# EAGLE schematic Armament HUD Control Panel (EAGLE 7.4.0)
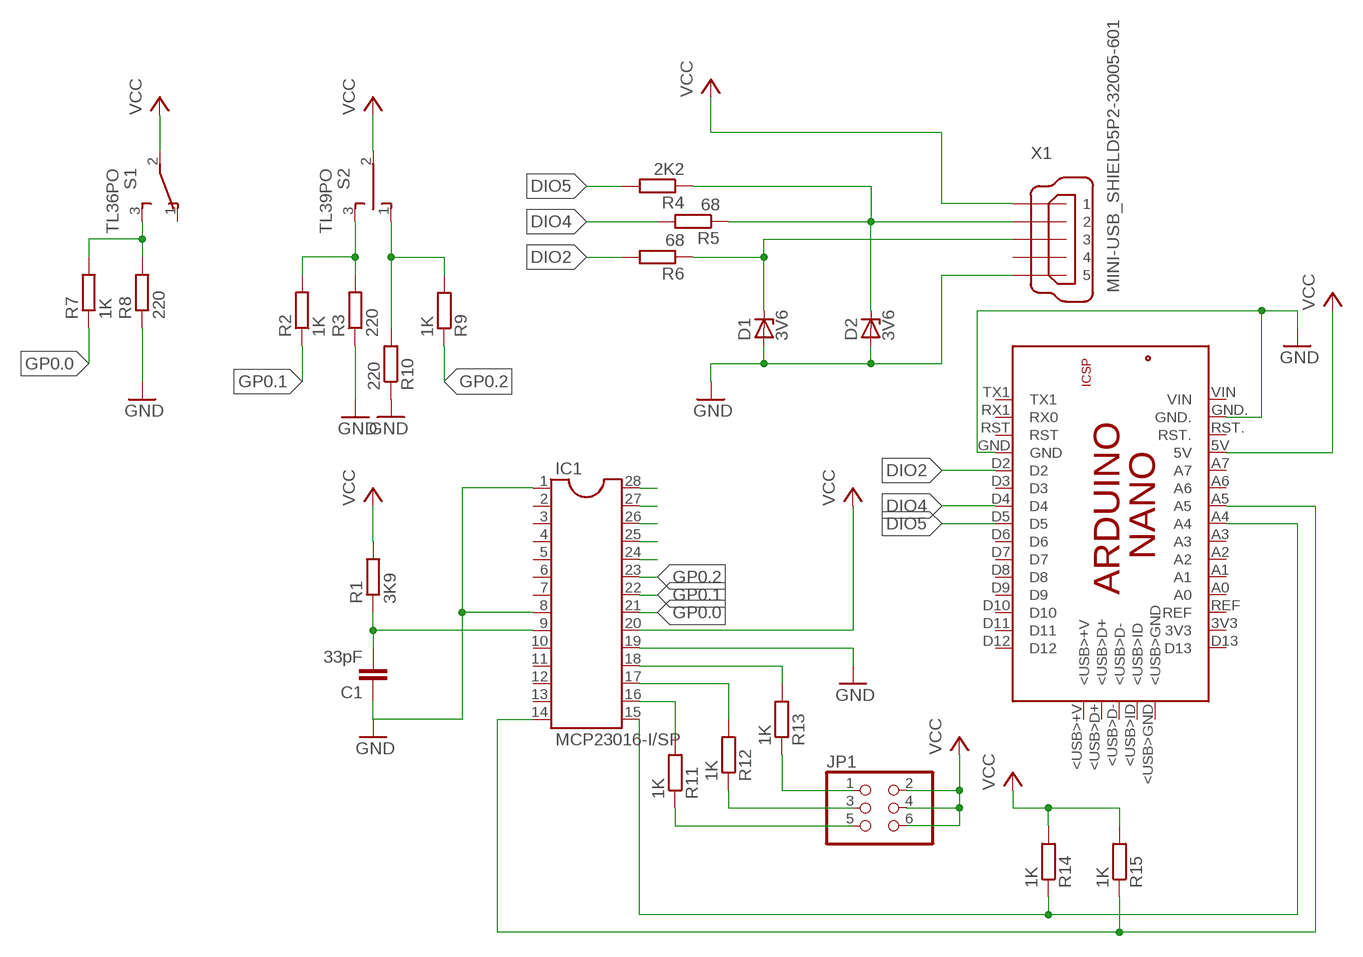
[diagram p0: schematic, sheet 1]

## Parts
C1  33pF  C-EU050-030X075  [C050-030X075]
D1  3V6  ZPD  [DO35Z10]
D2  3V6  ZPD  [DO35Z10]
IC1  MCP23016-I/SP  DIL28-3  [DIL28-3]
JP1  PINHD-2X3  [2X03]
PCB1  ARDUINO_NANO  [ARDUINO_NANO]
R1  3K9  R-EU_0204/7  [0204/7]
R2  1K  R-EU_0204/7  [0204/7]
R3  220  R-EU_0204/7  [0204/7]
R4  2K2  R-EU_0204/7  [0204/7]
R5  68  R-EU_0204/7  [0204/7]
R6  68  R-EU_0204/7  [0204/7]
R7  1K  R-EU_0204/7  [0204/7]
R8  220  R-EU_0204/7  [0204/7]
R9  1K  R-EU_0204/7  [0204/7]
R10  220  R-EU_0204/7  [0204/7]
R11  1K  R-EU_0204/7  [0204/7]
R12  1K  R-EU_0204/7  [0204/7]
R13  1K  R-EU_0204/7  [0204/7]
R14  1K  R-EU_0204/7  [0204/7]
R15  1K  R-EU_0204/7  [0204/7]
S1  TL36PO  [TL3XPO]
S2  TL39PO  [TL3XPO]
X1  MINI-USB_SHIELD5P2-32005-601  [32005-601]

## Nets
DIO2: PCB1.D2 R6.2
DIO4: PCB1.D4 R5.2
DIO5: PCB1.D5 R4.2
GND: C1.1 D1.A D2.A IC1.1 IC1.8 IC1.19 PCB1.GND PCB1.GND. R3.1 R8.1 R10.1 X1.5
GP0.0: IC1.21 R7.1
GP0.1: IC1.22 R2.1
GP0.2: IC1.23 R9.1
N$1: C1.2 IC1.9 R1.1
N$2: IC1.18 R13.2
N$3: IC1.17 R12.2
N$4: JP1.5 R11.1
N$5: D1.C R6.1 X1.3
N$6: D2.C R4.1 R5.1 X1.2
N$7: R7.2 R8.2 S1.3(S)
N$8: IC1.15 PCB1.A4 R14.1
N$9: IC1.14 PCB1.A5 R15.1
N$10: R2.2 R3.2 S2.3(S)
N$11: IC1.16 R11.2
N$12: JP1.3 R12.1
N$13: IC1.24
N$14: IC1.25
N$15: IC1.26
N$16: IC1.27
N$17: IC1.28
N$18: R9.2 R10.2 S2.1(O)
N$19: JP1.1 R13.1
VCC: IC1.20 JP1.2 JP1.4 JP1.6 PCB1.5V R1.2 R14.2 R15.2 S1.2(P) S2.2(P) X1.1
Unconnected: IC1.2 IC1.3 IC1.4 IC1.5 IC1.6 IC1.7 IC1.10 IC1.11 IC1.12 IC1.13 PCB1.3V3 PCB1.5V. PCB1.<USB>+V PCB1.<USB>D+ PCB1.<USB>D- PCB1.<USB>GND PCB1.<USB>ID PCB1.A0 PCB1.A1 PCB1.A2 PCB1.A3 PCB1.A6 PCB1.A7 PCB1.D3 PCB1.D6 PCB1.D7 PCB1.D8 PCB1.D9 PCB1.D10 PCB1.D11 PCB1.D12 PCB1.D13 PCB1.GND_ PCB1.MISO PCB1.MOSI PCB1.REF PCB1.RESET.. PCB1.RST PCB1.RST. PCB1.RX1(RX0) PCB1.SCK PCB1.TX1 PCB1.VIN S1.1(O) X1.4 X1.M1(S1) X1.M2(S2)

## Library data of the parts
C1 = resistor:C-EU: CAPACITOR, European symbol
D1 D2 = diode:ZPD: Z DIODE 500 mW
IC1 = ic-package:DIL28: Dual In Line
JP1 = pinhead:PINHD-2X3: PIN HEADER
PCB1 = E14_Arduino_revB:ARDUINO_NANO: Device for representing an Arduino Nano board with a footprint in an EAGLE design. Created by Dave Young for Element14. More EAGLE documentation at: http://www.element14.com/community/community/knode/cadsoft_eagle
R1-R15 = resistor:R-EU_: RESISTOR, European symbol
S1 = switch:TL36PO: TINY SWITCH ON - ON Source: http://www2.produktinfo.conrad.com/datenblaetter/700000-724999/705152-da-01-de-Subminiaturschalter_TL_36YO.pdf
S2 = switch:TL39PO: TINY SWITCH ON OFF ON Source: http://www2.produktinfo.conrad.com/datenblaetter/700000-724999/705152-da-01-de-Subminiaturschalter_TL_36YO.pdf
X1 = con-cypressindustries:MINI-USB_SHIELD5P2-: MINI USB-B R/A DIP 5pol. Source: www.cypressindustries.com; OC_FARNELL: unknown; OC_NEWARK: unknown